# EAGLE design Sanguinololu Thermocouple (EAGLE 5.11)
MF: SAMTEC; MPN: SSW-105-02-G-D; OC_FARNELL: 1668348
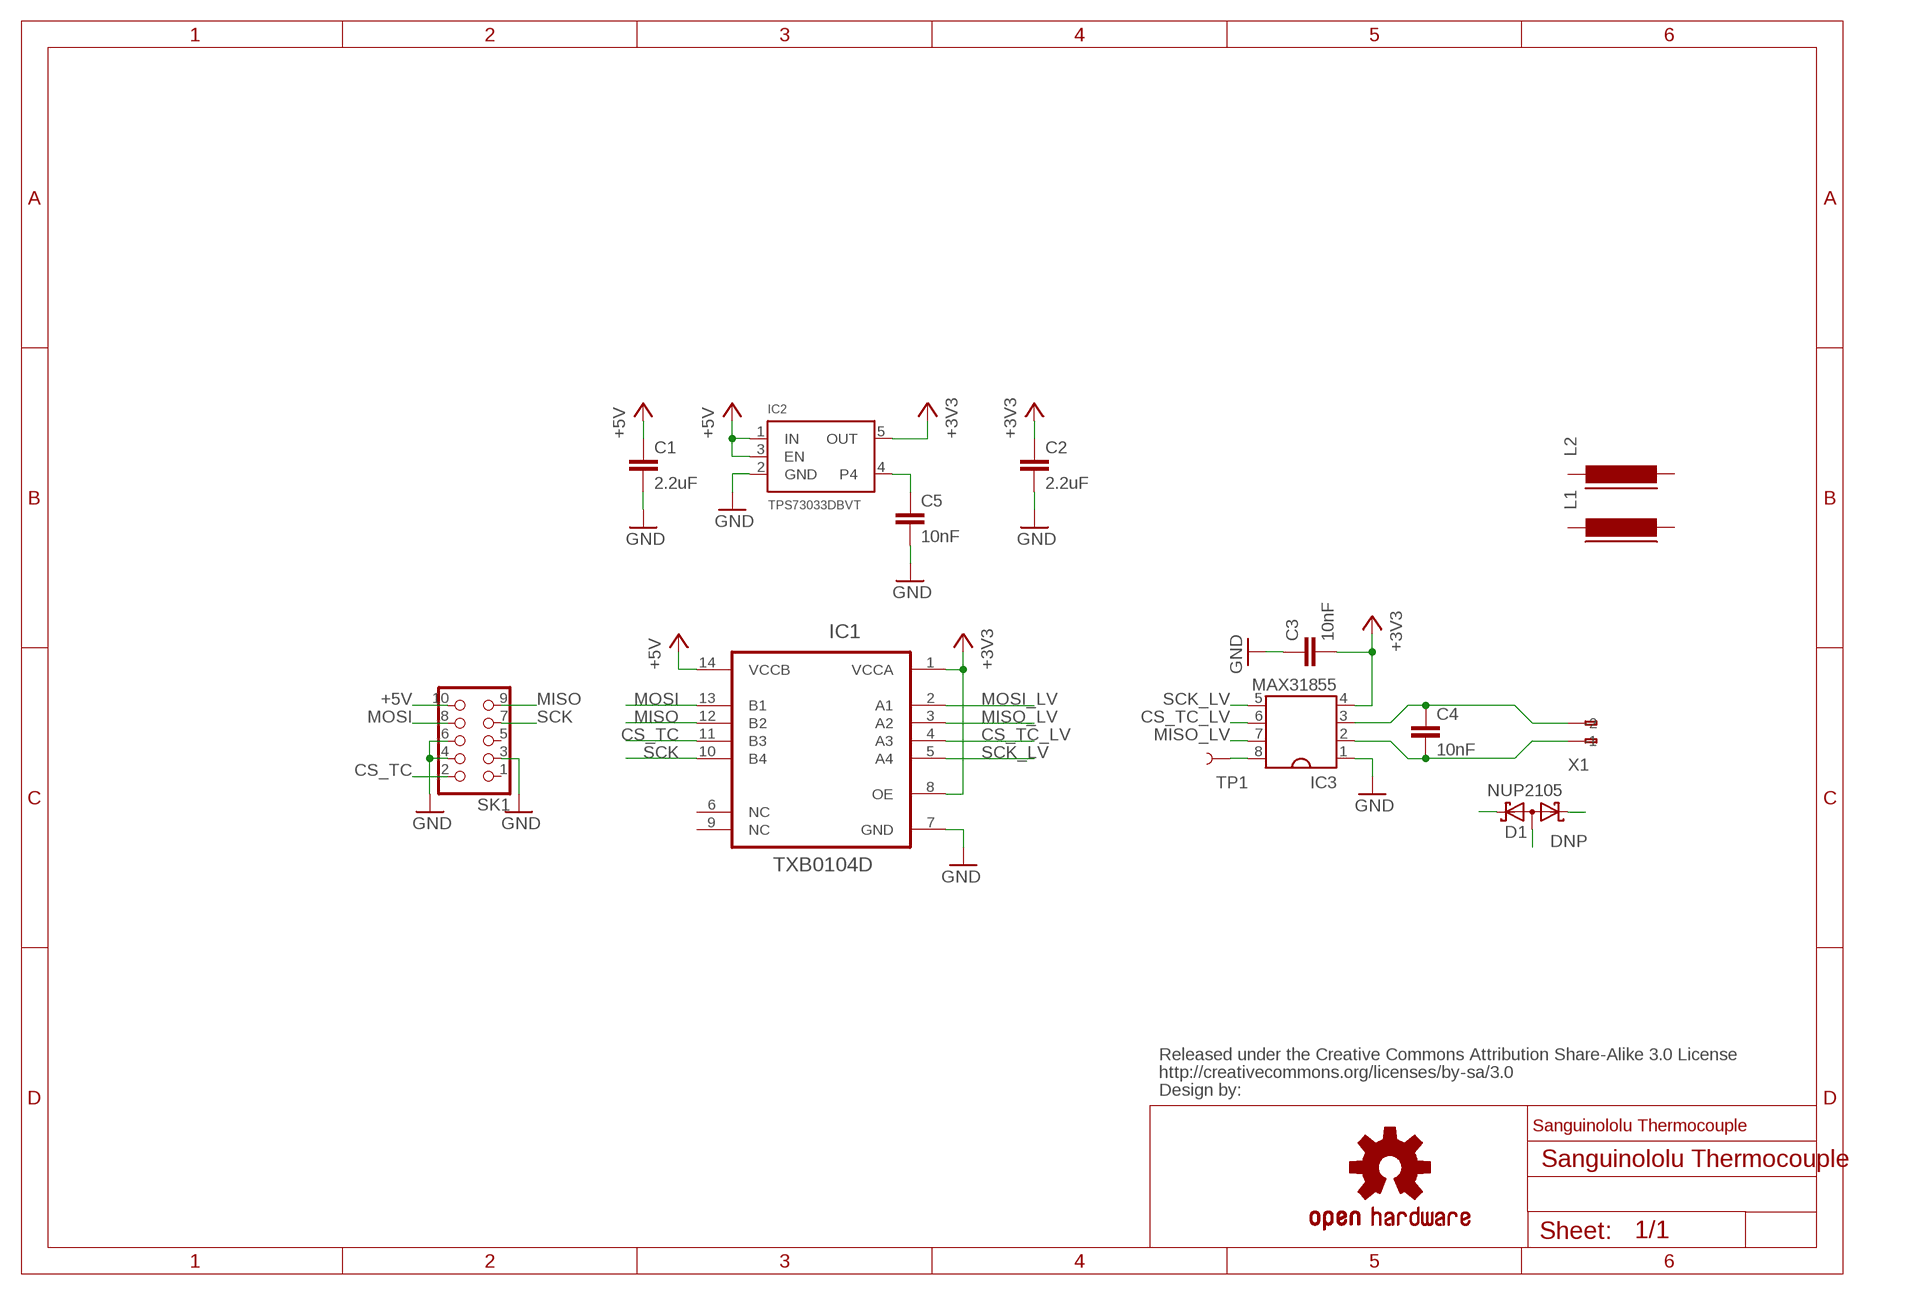
[diagram p0: schematic, sheet 1]

## Parts
C1  2.2uF  C-EUC1206K  [C1206K]
C2  2.2uF  C-EUC1206K  [C1206K]
C3  10nF  C-EUC0805  [C0805]
C4  10nF  C-EUC0805  [C0805]
C5  10nF  C-EUC0805  [C0805]
D1  NUP2105  BAS70-06  [SOT23]
IC1  TXB0104D  [SO14]
IC2  TPS73033DBVT  VREG_SOT23-5  [SOT23-5]
IC3  MAX31855  SO8  [SO8]
L1  FERRITE-0603  [FB603]
L2  FERRITE-0603  [FB603]
SK1  CON_HEADER_2X05-PTH  [M2X5]
TP1  TEST-POINT3X5  [PAD.03X.05]
U$1  CREATIVE_COMMONS  [CREATIVE_COMMONS]
U$2  OSHW-LOGOM  [OSHW-LOGO-M]
X1  234-502  [234-502]

## Nets
+3V3: C2.1 C3.2 IC1.1(VCCA) IC1.8(OE) IC2.5(OUT) IC3.4
+5V: C1.1 IC1.14(VCCB) IC2.1(IN) IC2.3(EN) SK1.10
CS_TC: IC1.11(B3) SK1.2
CS_TC_LV: IC1.4(A3) IC3.6
GND: C1.2 C2.2 C3.1 C5.2 D1.3(AA) IC1.7(GND) IC2.2(GND) IC3.1 SK1.3 SK1.4 SK1.6
MISO: IC1.12(B2) SK1.9
MISO_LV: IC1.3(A2) IC3.7
MOSI: IC1.13(B1) SK1.8
MOSI_LV: IC1.2(A1)
N$1: C5.1 IC2.4
N$2: IC3.8 TP1.P$1
SCK: IC1.10(B4) SK1.7
SCK_LV: IC1.5(A4) IC3.5
T+: C4.1 D1.1(K1) IC3.3 X1.A2(-2) X1.B2(B-2)
T-: C4.2 D1.2(K2) IC3.2 X1.A1(-1) X1.B1(B-1)
Unconnected: IC1.6(NC) IC1.9(NC) L1.1 L1.2 L2.1 L2.2 SK1.1 SK1.5

## Notes on the sheet
- DNP
- Sanguinololu Thermocouple

## Library data of the parts
C1-C5 = rcl:C-EU: CAPACITOR, European symbol
D1 = diode:BAS70-06: Silicon Schottky Diodes General-purpose diode for high-speed switching
IC1 = General:TXB0104D: 4-BIT BIDIRECTIONAL VOLTAGE-LEVEL TRANSLATOR WITH AUTOMATIC DIRECTION SENSING AND ±15-kV ESD PROTECTION
IC2 = microbuilder:VREG_SOT23-5: SOT23-5 Fixed Voltage Regulators To better organise some of the SOT23-5 fixed voltage regulators in this library, this new part was created. Part Current Out V Out V In V Dropout Digikey Part No. ADP121 150mA 3.3V 3.4-5.5V 0.09V @ 150mA ADP121-AUJZ33R7CT-ND ADP121 150mA 3.0V 3.1-5.5V 0.09V @ 150mA ADP121-AUJZ30R7CT-ND ADP122 300mA 3.3V 3.4-5.5V 0.085V @ 300mA ADP122AUJZ-3.3-R7CT-ND ADP1712 300mA 3.3V 3.5-5.5V 0.17V @ 300mA ADP1712AUJZ-3.3-R7TR-ND AP7311 (Low Cost) 150mA 3.3V 3.5-6V 0.15V @ 150mA AP7311-33WG-7DICT-ND LD39015M18R 150mA 1.8V 1.9V-5.5V 0.08V @ 100mA 497-6977-1-ND MCP1824T-3302E/OT 300mA 3.3V 3.5V-6V 0.2V @ 300mA MCP1824T-3302E/OTCT-ND MIC5205-2.5YM5 TR 150mA 2.5V 2.7-16V 0.165V @ 150mA 576-1257-2-ND MIC5205-3.0YM5 TR 150mA 3.0V 3.2V-16V 0.165V @ 150mA 576-1258-2-ND MIC5205-3.3YM5 TR 150mA 3.3V 3.5V-16V 0.165V @ 150mA 576-1259-2-ND TPS780330220 150mA 3.3V+2.2V 3.6-5.5V 250mV Max 296-23332-1-ND TDA3663/N1,135 100mA 3.3V 3.5-45V 0.18V @ 50mA 568-5343-1-ND
IC3 = General:SO8
L1 L2 = dp_devices:FERRITE: Ferrite bead in various packages
SK1 = dp_devices:CON_HEADER_2X05: 2x05 pin header
TP1 = SparkFun march 2012:TEST-POINT
U$1 = SparkFun:CREATIVE_COMMONS
U$2 = SparkFun march 2012:OSHW-LOGO: Open Source Hardware Logo This logo indicates the piece of hardware it is found on incorporates a OSHW license and/or adheres to the definition of open source hardware found here: http://freedomdefined.org/OSHW
X1 = con-wago:234-502: WAGO Cage Clamp

## Net classes
1 edge: clearance 0.254 mm

## Board
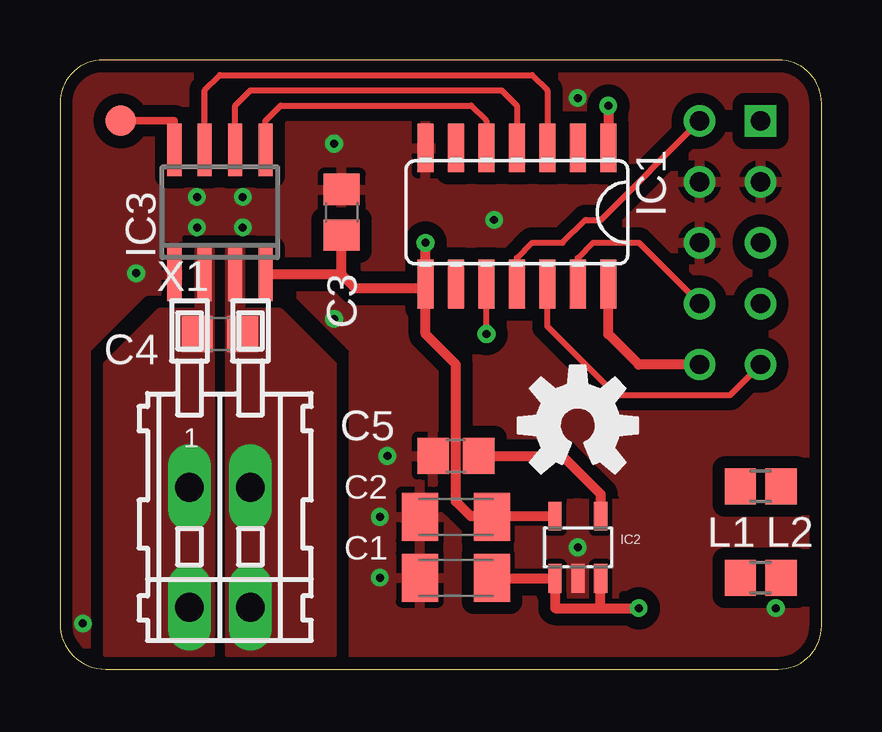
[diagram p1: board, top side]
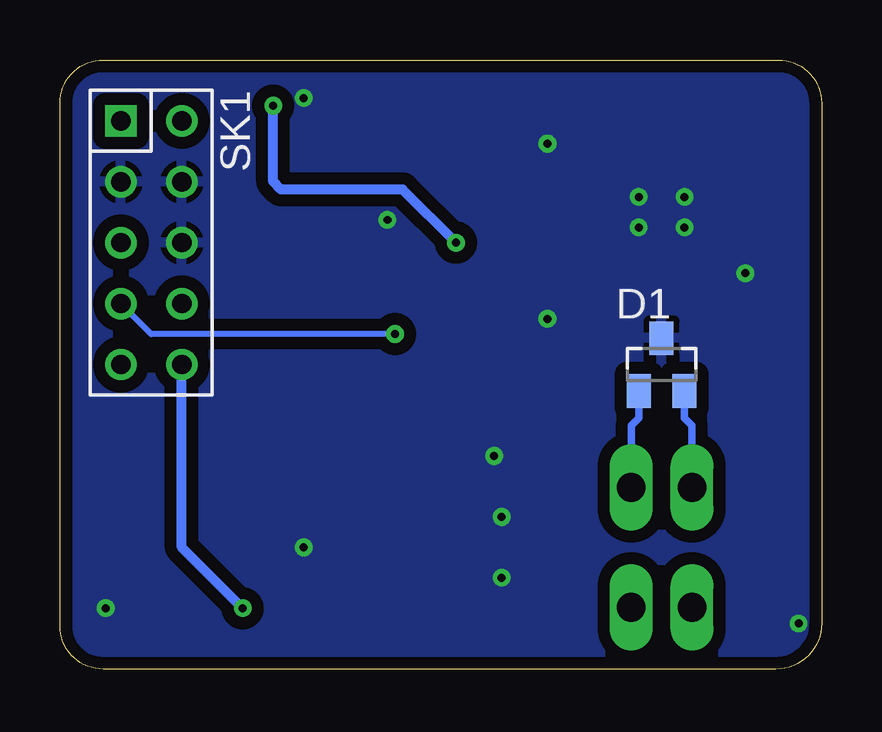
[diagram p2: board, bottom side, seen from below]

Size 31.75 x 25.4 mm. Coordinates in mm from the lower left corner, seen from the top.
Outline: 31.75,23.6 arc90 29.95,25.4 1.8,25.4 arc90 0,23.6 0,1.91 arc90 1.91,0 29.95,0 arc90 31.75,1.8 31.75,23.6
Copper layers (1*16): Top 0.035mm / dielectric 1.5mm / Bottom 0.035mm
Design rules "default *": minimum track width 10mil, minimum drill 24mil, track to track 8mil, track to pad 8mil, pad to pad 8mil, via to via 8mil, smd to smd 8mil, copper to edge 4mil, drill to drill 8mil, minimum pad ring 10mil, minimum via ring 8mil, stop-mask expansion 4mil, vias tented up to drill 0mil, thermal gap 10mil

### Footprints (pad centres in the part's own frame; a part is rotated, then mirrored left to right if it is on the bottom)
C1206K = smd 1.5 x 2: 1 -1.5,0; 2 1.5,0
C0805 = smd 1.3 x 1.5: 1 -0.95,0; 2 0.95,0
SOT23 = smd 1 x 1.4: 1 -0.95,-1.1; 2 0.95,-1.1; 3 0,1.1
SO14 = smd 0.66 x 2.032: 1 -3.81,-2.68; 2 -2.54,-2.68; 3 -1.27,-2.68; 4 0,-2.68; 5 1.27,-2.68; 6 2.54,-2.68; 7 3.81,-2.68; 8 3.81,2.997; 9 2.54,2.997; 10 1.27,2.997; 11 0,2.997; 12 -1.27,2.997; 13 -2.54,2.997; 14 -3.81,2.997
SOT23-5 = smd 0.55 x 1.2: 1 -0.95,-1.3; 2 0,-1.3; 3 0.95,-1.3; 4 0.95,1.3; 5 -0.95,1.3
SO8 = smd 0.6 x 2.2: 1 -1.905,-2.6; 2 -0.635,-2.6; 3 0.635,-2.6; 4 1.905,-2.6; 5 1.905,2.6; 6 0.635,2.6; 7 -0.635,2.6; 8 -1.905,2.6
FB603 = smd 1.3 x 1.5: 1 -0.85,0; 2 0.85,0
M2X5 = drill 0.8 square: 1 -5.08,-1.27 | drill 0.8 round: 2 -5.08,1.27; 3 -2.54,-1.27; 4 -2.54,1.27; 5 0,-1.27; 6 0,1.27; 7 2.54,-1.27; 8 2.54,1.27; 9 5.08,-1.27; 10 5.08,1.27
PAD.03X.05 = smd 1.27 x 1.27: P$1 0,0
234-502 = drill 1.2 long: A1 -1.27,2.5; A2 1.27,2.5; B1 -1.27,-2.5; B2 1.27,-2.5

### Placement (x,y rotation side)
C1  16.51,3.81 180 top
C2  16.51,6.35 180 top
C3  11.75,19.05 270 top
C4  6.67,13.97 180 top
C5  16.51,8.89 180 top
D1  6.67,12.7 0 bottom
IC1  19.05,19.05 180 top
IC2  21.59,5.08 0 top
IC3  6.67,19.05 0 top
L1  29.21,3.81 0 top
L2  29.21,7.62 180 top
SK1  27.94,17.78 270 bottom
TP1  2.54,22.86 0 top
U$1  -2.54,33.02 0 top  (outside the outline)
U$2  21.59,10.16 0 top
X1  6.67,5.08 0 top

### Tracks (layer width: path | path; a pad name or v marks a point on that pad's centre or on a via)
+3V3  (via drill 0.33)
  Top 0.406: 18.01,6.38 C2.1 | 18.01,6.38 IC2.5 | 11.75,16.45 IC3.4 | 11.75,16.45 C3.2 | v22.86,23.5 IC1.1 | IC1.8 15.24,13.97 16.51,12.7 16.51,6.99 17.11,6.38 18.01,6.38 | IC1.8 v15.24,17.78 | IC1.8 arc-90 15.06,15.88 12.32,15.88 11.75,16.45
  Bottom 0.406: v22.86,23.5 22.86,20.32 22.54,20 17.46,20 v15.24,17.78
+5V  (via drill 0.33)
  Top 0.406: C1.1 18.01,3.78 IC2.1 20.64,2.54 22.54,2.54 | 22.54,2.54 IC2.3 | SK1.10 24.13,12.7 22.86,13.97 IC1.14 | 22.54,2.54 v24.13,2.54
  Bottom 0.406: SK1.10 26.67,5.08 v24.13,2.54
CS_TC
  Top 0.254: SK1.2 22.54,18.73 21.91,18.73 20.95,17.78 19.68,17.78 19.05,17.14 IC1.11
CS_TC_LV
  Top 0.254: IC3.6 7.3,23.5 7.94,24.13 18.41,24.13 19.05,23.5 IC1.4
GND  (via drill 0.33)
  other vias: 11.43,21.91 13.65,8.89 29.84,2.54 3.17,16.51 21.59,23.81 21.59,5.08 11.43,14.61 13.34,6.35 13.34,3.81 5.71,19.68 5.71,18.41 7.62,18.41 7.62,19.68 18.1,18.73 0.95,1.91
  pour Top (isolate 0.508, rank 6): 0,25.4 31.75,25.4 31.75,0 0,0
  pour Bottom (isolate 0.508, rank 6): 0,0 31.75,0 31.75,25.4 0,25.4
  pour Top (no thermals): 19.05,6.99 23.5,6.99 23.5,3.49 23.18,3.17 23.18,1.59 19.05,1.59
MISO
  Top 0.254: SK1.9 27.94,11.43 23.18,11.43 20.32,14.29 IC1.12
MISO_LV
  Top 0.254: IC3.7 6.03,24.13 6.67,24.77 19.68,24.77 20.32,24.13 IC1.3
MOSI
  Top 0.254: IC1.13 21.59,17.14 22.23,17.78 24.13,17.78 SK1.8
N$1
  Top 0.406: IC2.4 22.54,7.3 20.95,8.89 C5.1
N$2
  Top 0.305: IC3.8 4.76,22.86 TP1.P$1
SCK  (via drill 0.33)
  Top 0.254: v17.78,13.97 IC1.10
  Bottom 0.254: SK1.7 27.94,13.97 v17.78,13.97
SCK_LV
  Top 0.254: IC3.5 8.57,22.86 9.21,23.5 17.14,23.5 17.78,22.86 IC1.5
T+
  Bottom 0.305: D1.1 7.62,10.48 7.94,10.16 X1.A2
  pour Top (no thermals): 6.99,17.46 6.99,0.64 11.43,0.64 11.43,12.7 9.21,14.92 7.62,14.92 7.62,17.46
T-
  Bottom 0.305: D1.2 5.72,10.48 5.4,10.16 X1.A1
  pour Top (no thermals): 1.91,0.64 6.35,0.64 6.35,17.46 5.71,17.46 5.71,14.92 4.13,14.92 1.91,12.7